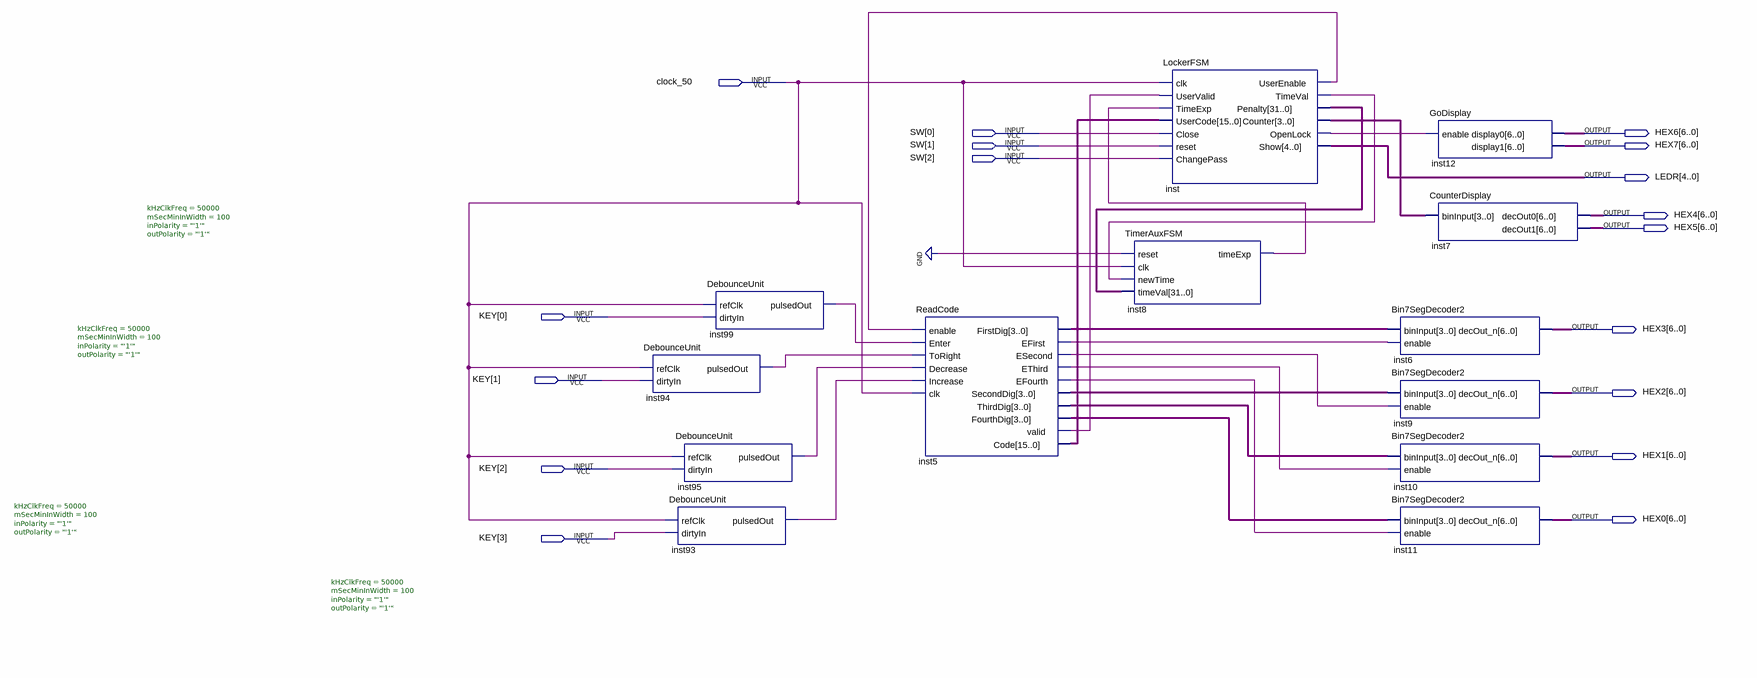
[diagram p0: schematic sheet]
// Quartus schematic Locker.bdf as structural Verilog: 13 symbols, 17 pins
module Locker (
  input  clock_50,
  input  [2:0] SW,
  input  [3:0] KEY,
  output [6:0] HEX6,
  output [6:0] HEX7,
  output [4:0] LEDR,
  output [6:0] HEX4,
  output [6:0] HEX5,
  output [6:0] HEX3,
  output [6:0] HEX2,
  output [6:0] HEX1,
  output [6:0] HEX0
);

  wire inst5_efirst, inst5_efourth, inst5_esecond, inst5_ethird, inst5_valid, inst8_timeexp,
       inst93_pulsedout, inst94_pulsedout, inst95_pulsedout, inst99_pulsedout, inst_openlock, inst_timeval,
       inst_userenable;
  wire [3:0] inst5_firstdig, inst5_fourthdig, inst5_seconddig, inst5_thirddig, inst_counter;
  wire [15:0] inst5_code;
  wire [31:0] inst_penalty;

  DebounceUnit #(.kHzClkFreq(50000), .mSecMinInWidth(100), .inPolarity("'1'"), .outPolarity("'1'")) inst94 (
    .refClk(clock_50), .dirtyIn(KEY[1]), .pulsedOut(inst94_pulsedout));
  DebounceUnit #(.kHzClkFreq(50000), .mSecMinInWidth(100), .inPolarity("'1'"), .outPolarity("'1'")) inst95 (
    .refClk(clock_50), .dirtyIn(KEY[2]), .pulsedOut(inst95_pulsedout));
  DebounceUnit #(.kHzClkFreq(50000), .mSecMinInWidth(100), .inPolarity("'1'"), .outPolarity("'1'")) inst93 (
    .refClk(clock_50), .dirtyIn(KEY[3]), .pulsedOut(inst93_pulsedout));
  DebounceUnit #(.kHzClkFreq(50000), .mSecMinInWidth(100), .inPolarity("'1'"), .outPolarity("'1'")) inst99 (
    .refClk(clock_50), .dirtyIn(KEY[0]), .pulsedOut(inst99_pulsedout));
  ReadCode inst5 (
    .enable(inst_userenable), .Enter(inst99_pulsedout), .ToRight(inst94_pulsedout),
    .Decrease(inst95_pulsedout), .Increase(inst93_pulsedout), .clk(clock_50), .FirstDig(inst5_firstdig),
    .EFirst(inst5_efirst), .ESecond(inst5_esecond), .EThird(inst5_ethird), .EFourth(inst5_efourth),
    .SecondDig(inst5_seconddig), .ThirdDig(inst5_thirddig), .FourthDig(inst5_fourthdig), .valid(inst5_valid),
    .Code(inst5_code));
  TimerAuxFSM inst8 (
    .reset(1'b0), .clk(clock_50), .newTime(inst_timeval), .timeVal(inst_penalty), .timeExp(inst8_timeexp));
  LockerFSM inst (
    .clk(clock_50), .UserValid(inst5_valid), .TimeExp(inst8_timeexp), .UserCode(inst5_code), .Close(SW[0]),
    .reset(SW[1]), .ChangePass(SW[2]), .UserEnable(inst_userenable), .TimeVal(inst_timeval),
    .Penalty(inst_penalty), .Counter(inst_counter), .OpenLock(inst_openlock), .Show(LEDR));
  Bin7SegDecoder2 inst6 (.binInput(inst5_firstdig), .enable(inst5_efirst), .decOut_n(HEX3));
  Bin7SegDecoder2 inst9 (.binInput(inst5_seconddig), .enable(inst5_esecond), .decOut_n(HEX2));
  Bin7SegDecoder2 inst10 (.binInput(inst5_thirddig), .enable(inst5_ethird), .decOut_n(HEX1));
  Bin7SegDecoder2 inst11 (.binInput(inst5_fourthdig), .enable(inst5_efourth), .decOut_n(HEX0));
  GoDisplay inst12 (.enable(inst_openlock), .display0(HEX6), .display1(HEX7));
  CounterDisplay inst7 (.binInput(inst_counter), .decOut0(HEX4), .decOut1(HEX5));
endmodule
